# Altium schematic sheet ultrasound_wifi.SchDoc: Schematic
size D; Date: Not shown in title block; ApprovedBy: Not shown in title block; CheckedBy: Not shown in title block; Author: Not shown in title block; CompanyName: Not shown in title block; DrawnBy: Giovanni Campanella; Engineer: Giovanni Campanella; Organization: Not shown in title block; Address1: Not shown in title block; Address2: Not shown in title block; Address3: Not shown in title block; Address4: Not shown in title block; DocumentNumber: 1; Revision: Use project parameter SCH_Rev; SheetNumber: 2; SheetTotal: 3; PageSetup: Record=PageOptions|CenterHorizontal=True|CenterVertical=True|PrintScale=1.00|XCorrection=1.00|YCorrection=1.00|PrintKind=0|BorderSize=5000000|LeftOffset=0|BottomOffset=0|Orientation=2|PaperLength=1000|PaperWidth=1000|Scale=100|PaperSource=15|PrintQuality=600|MediaType=1|DitherType=10|PaperKind=Letter|PrintScaleMode=1; CurrentTime: Not shown in title block; CurrentDate: Not shown in title block; Time: Not shown in title block; DocumentFullPathAndName: Not shown in title block; DocumentName: Not shown in title block; ModifiedDate: Not shown in title block; ImagePath: Not shown in title block
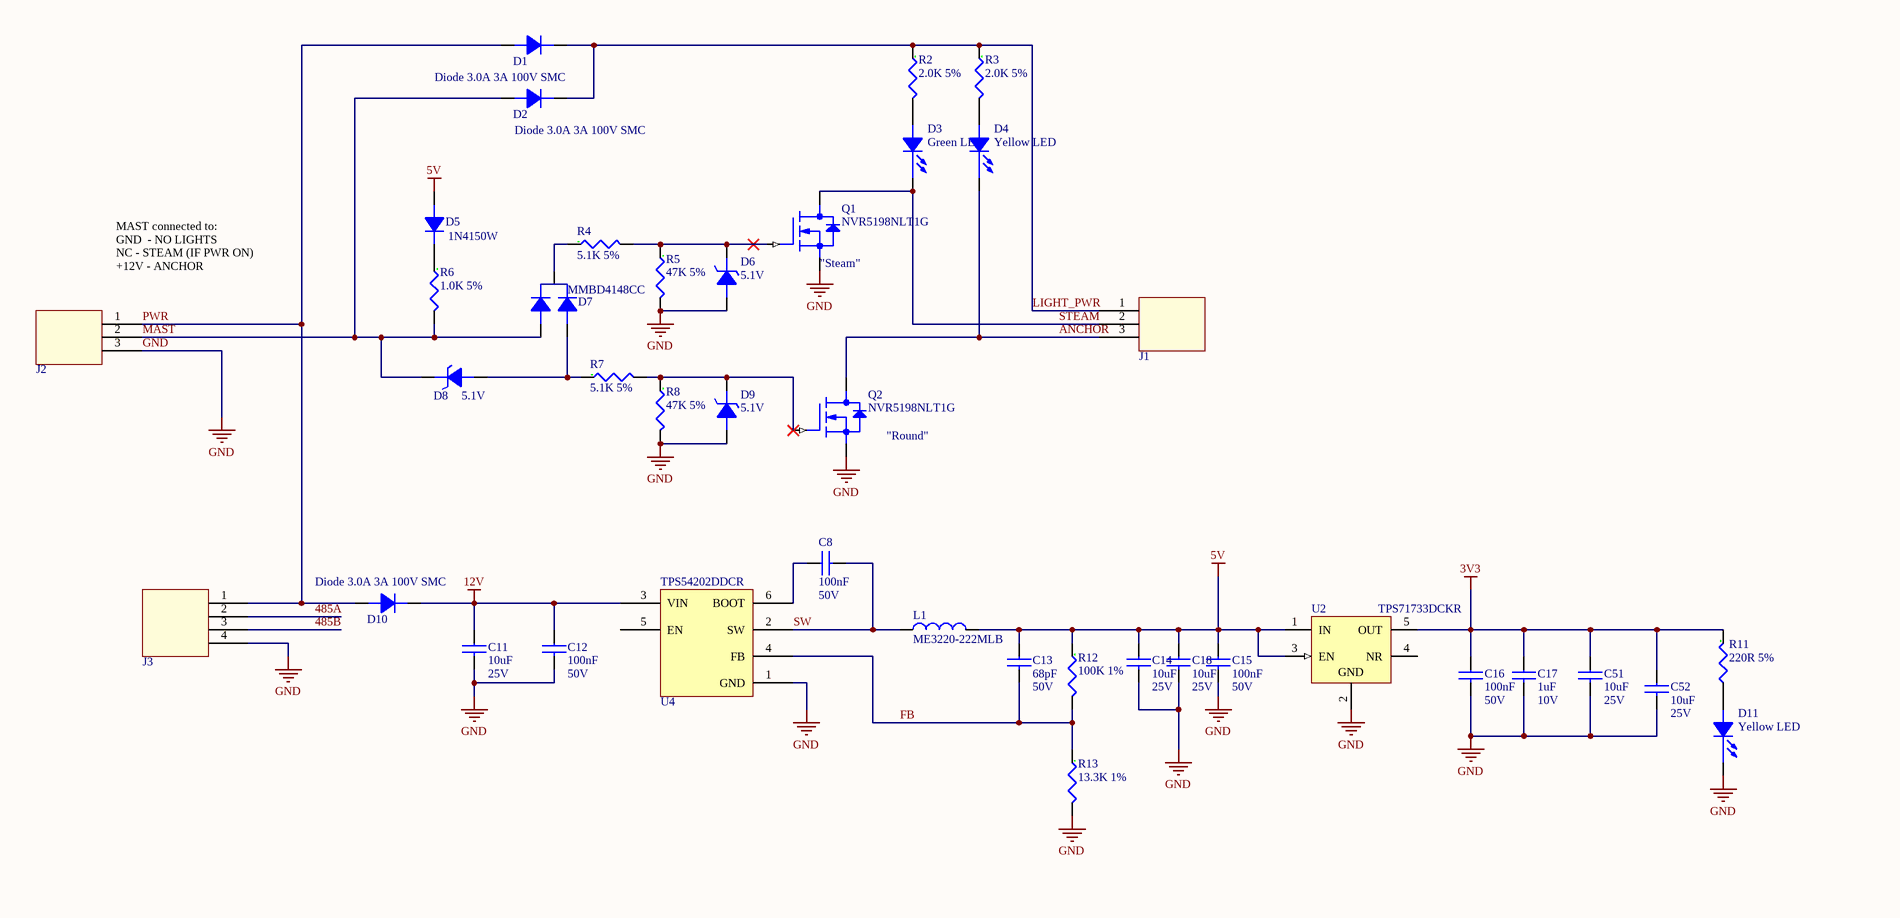
[diagram p0: ultrasound_wifi.SchDoc, top left]
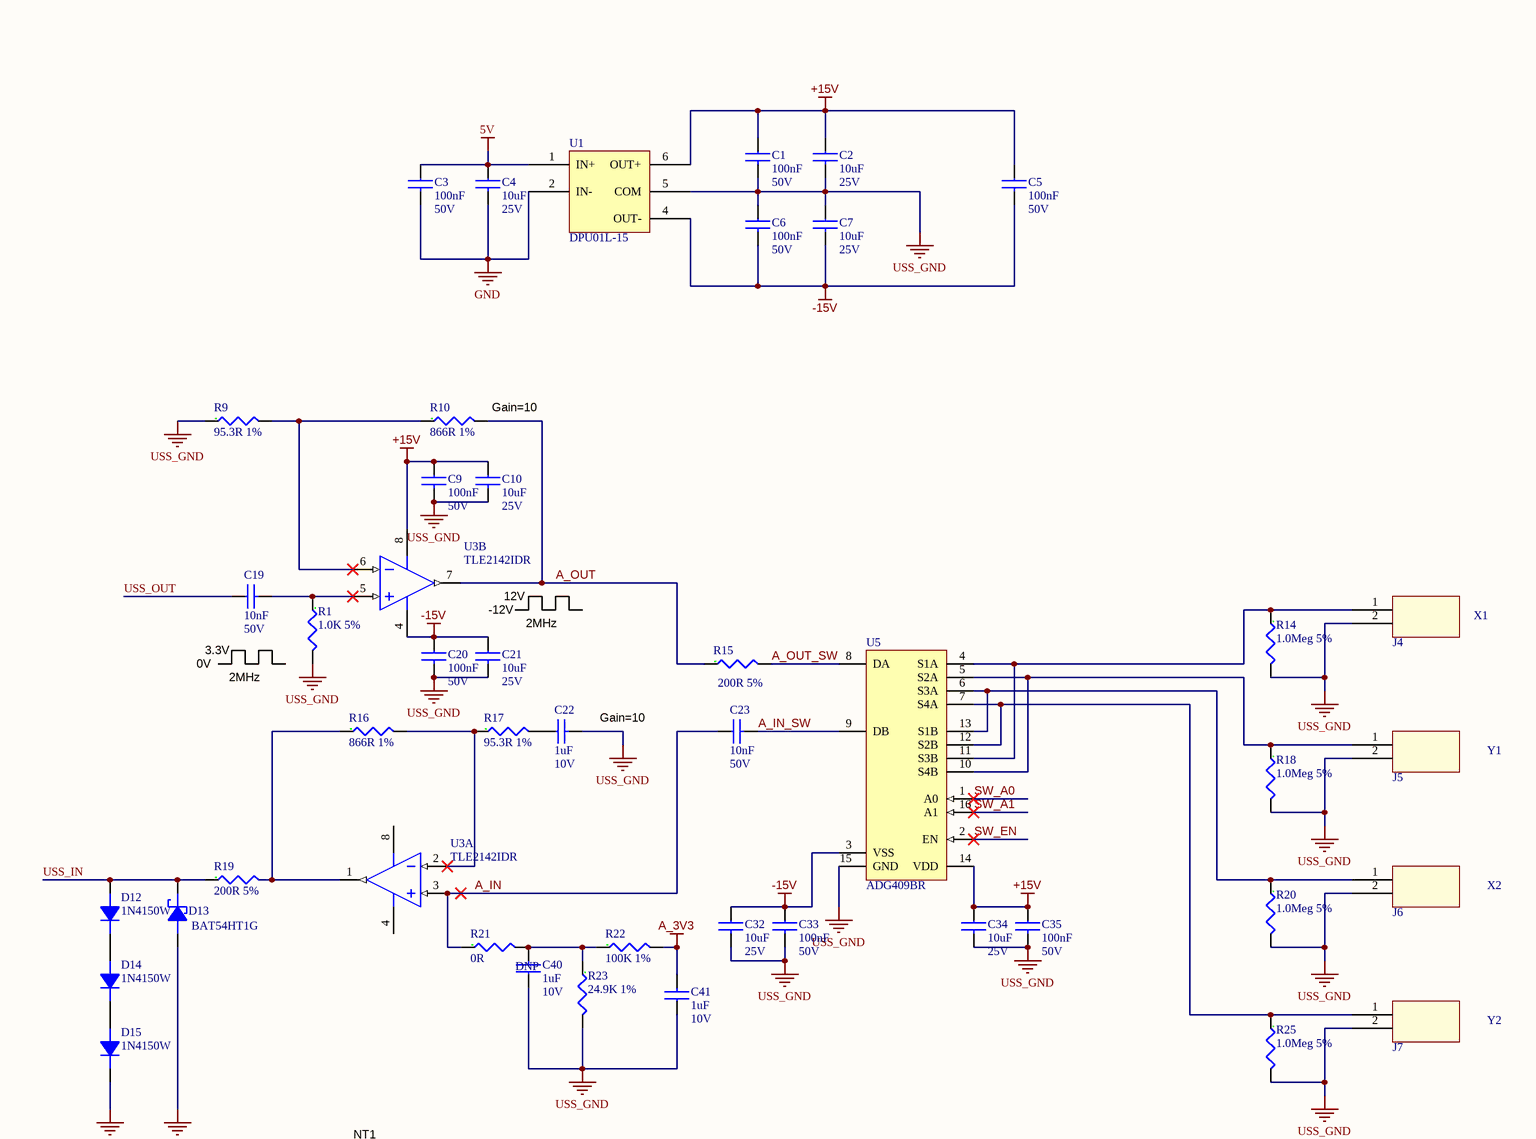
[diagram p1: ultrasound_wifi.SchDoc, top right]
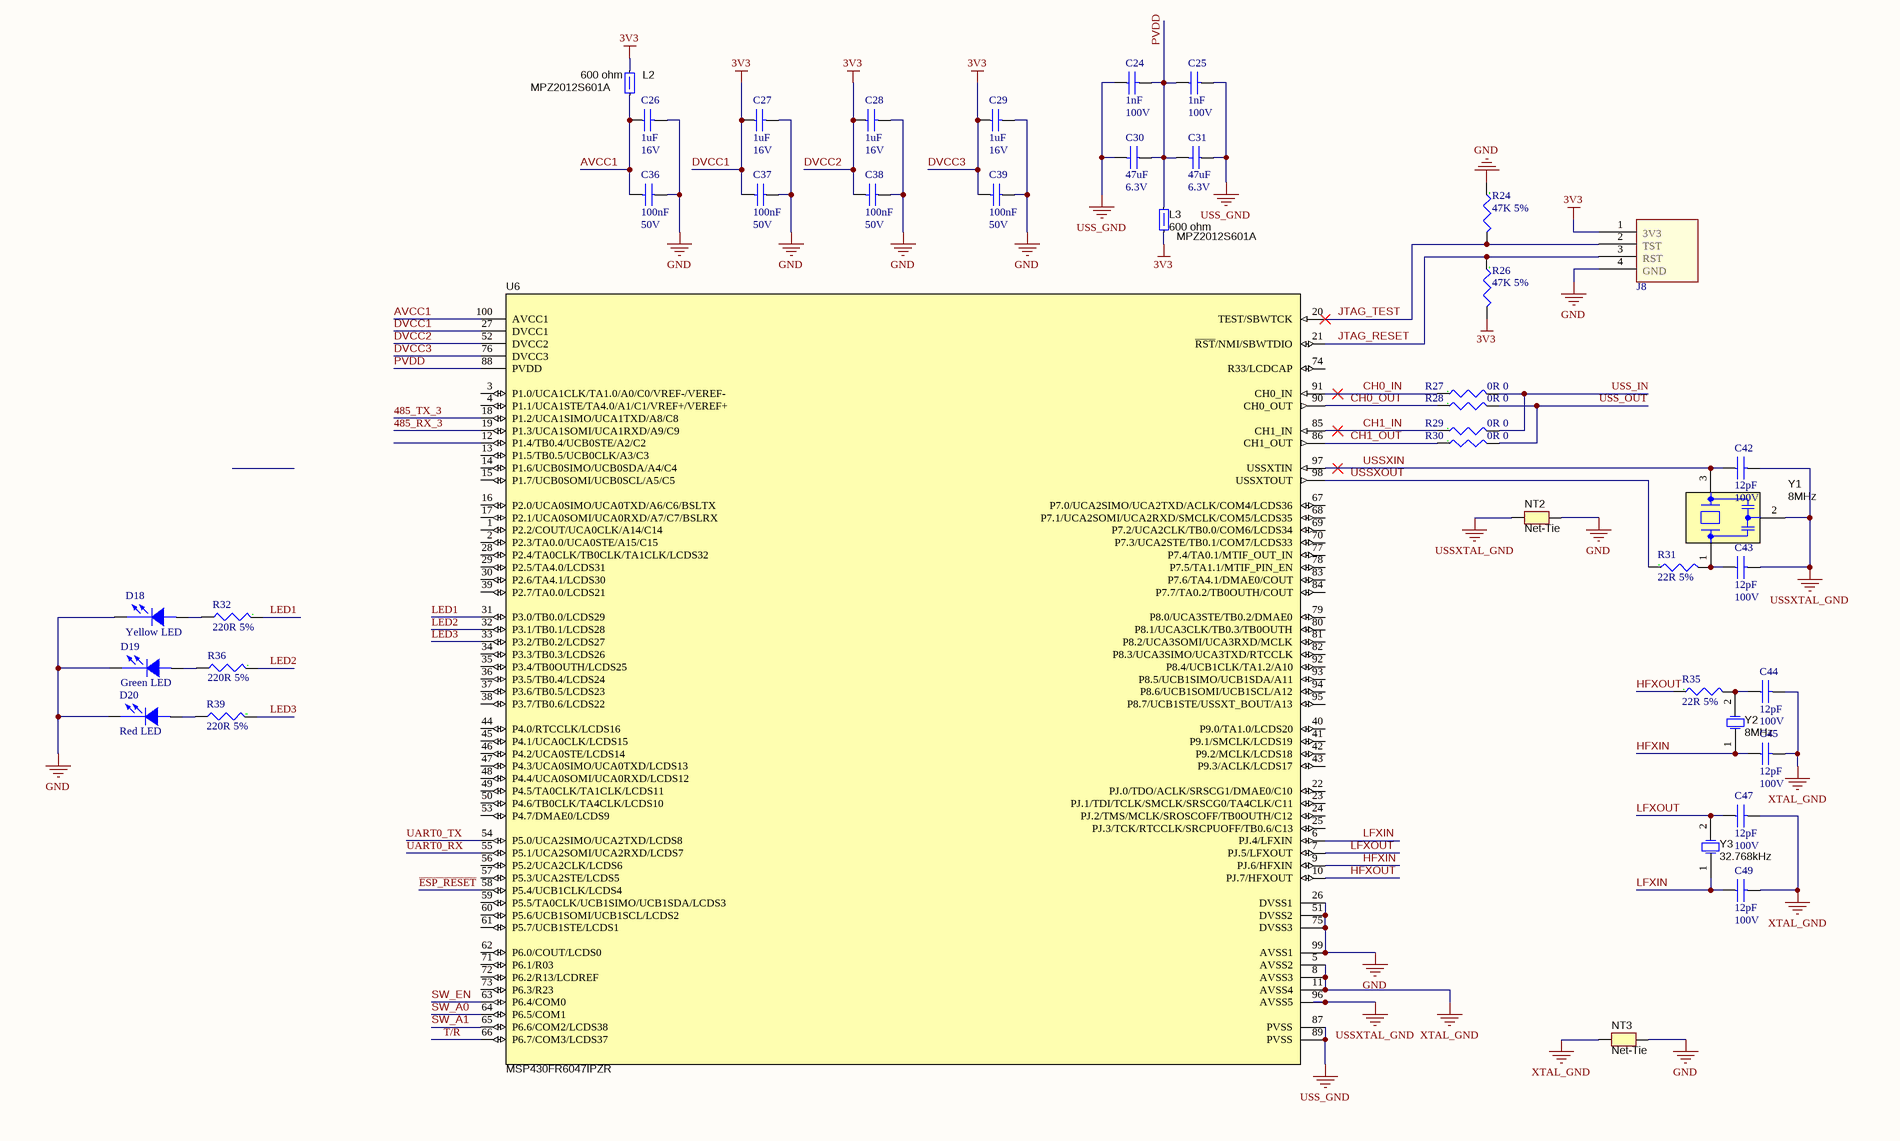
[diagram p2: ultrasound_wifi.SchDoc, bottom left]
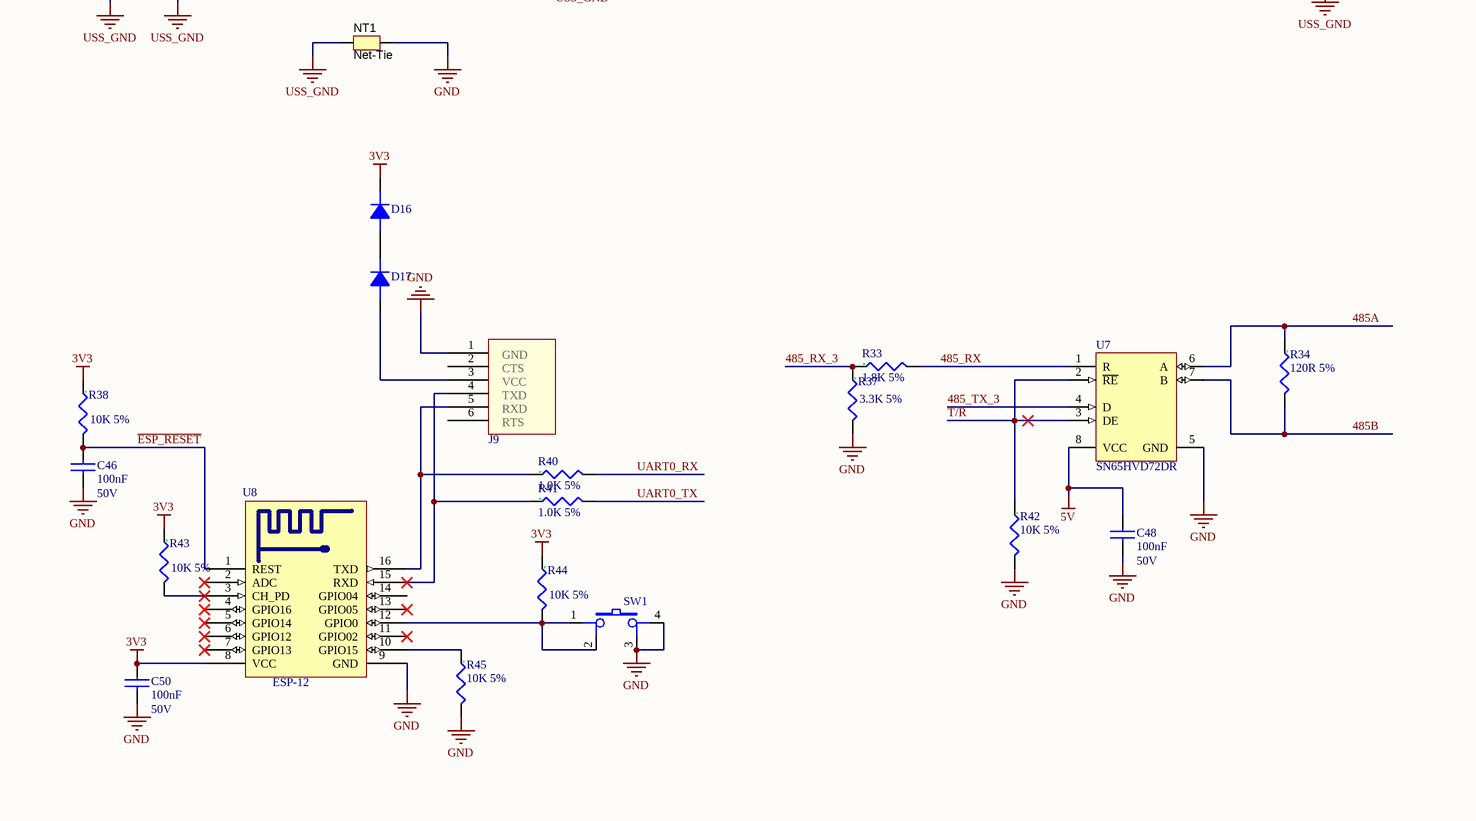
[diagram p3: ultrasound_wifi.SchDoc, bottom right]

## Parts
C1  value 100nF  Rated Voltage: 50V  [C_0603C]  (hidden comment: 100nF 50V)
C2  value 10uF  Rated Voltage: 25V  [C_0805C]  (hidden comment: 10uF 25V)
C3  value 100nF  Rated Voltage: 50V  [C_0603C]  (hidden comment: 100nF 50V)
C4  value 10uF  Rated Voltage: 25V  [C_0805C]  (hidden comment: 10uF 25V)
C5  value 100nF  Rated Voltage: 50V  [C_0603C]  (hidden comment: 100nF 50V)
C6  value 100nF  Rated Voltage: 50V  [C_0603C]  (hidden comment: 100nF 50V)
C7  value 10uF  Rated Voltage: 25V  [C_0805C]  (hidden comment: 10uF 25V)
C8  value 100nF  Rated Voltage: 50V  [C_0603C]  (hidden comment: 100nF 50V)
C9  value 100nF  Rated Voltage: 50V  [C_0603C]  (hidden comment: 100nF 50V)
C10  value 10uF  Rated Voltage: 25V  [C_0805C]  (hidden comment: 10uF 25V)
C11  value 10uF  Rated Voltage: 25V  [C_0805C]  (hidden comment: 10uF 25V)
C12  value 100nF  Rated Voltage: 50V  [C_0603C]  (hidden comment: 100nF 50V)
C13  value 68pF  Rated Voltage: 50V  [C_0603C]  (hidden comment: 68pF 50V)
C14  value 10uF  Rated Voltage: 25V  [C_0805C]  (hidden comment: 10uF 25V)
C15  value 100nF  Rated Voltage: 50V  [C_0603C]  (hidden comment: 100nF 50V)
C16  value 100nF  Rated Voltage: 50V  [C_0603C]  (hidden comment: 100nF 50V)
C17  value 1uF  Rated Voltage: 10V  [C_0603C]  (hidden comment: 1uF 10V)
C18  value 10uF  Rated Voltage: 25V  [C_0805C]  (hidden comment: 10uF 25V)
C19  value 10nF  Rated Voltage: 50V  [C_0603C]  (hidden comment: 10nF 50V)
C20  value 100nF  Rated Voltage: 50V  [C_0603C]  (hidden comment: 100nF 50V)
C21  value 10uF  Rated Voltage: 25V  [C_0805C]  (hidden comment: 10uF 25V)
C22  value 1uF  Rated Voltage: 10V  [C_0603C]  (hidden comment: 1uF 10V)
C23  value 10nF  Rated Voltage: 50V  [C_0603C]  (hidden comment: 10nF 50V)
C24  value 1nF  Rated Voltage: 100V  [C_0603C]  (hidden comment: 1nF 100V)
C25  value 1nF  Rated Voltage: 100V  [C_0603C]  (hidden comment: 1nF 100V)
C26  value 1uF  Rated Voltage: 16V  [C_0603C]  (hidden comment: 1uF 16V)
C27  value 1uF  Rated Voltage: 16V  [C_0603C]  (hidden comment: 1uF 16V)
C28  value 1uF  Rated Voltage: 16V  [C_0603C]  (hidden comment: 1uF 16V)
C29  value 1uF  Rated Voltage: 16V  [C_0603C]  (hidden comment: 1uF 16V)
C30  value 47uF  Rated Voltage: 6.3V  [C_0805C]  (hidden comment: 47uF 6.3V)
C31  value 47uF  Rated Voltage: 6.3V  [C_0805C]  (hidden comment: 47uF 6.3V)
C32  value 10uF  Rated Voltage: 25V  [C_0805C]  (hidden comment: 10uF 25V)
C33  value 100nF  Rated Voltage: 50V  [C_0603C]  (hidden comment: 100nF 50V)
C34  value 10uF  Rated Voltage: 25V  [C_0805C]  (hidden comment: 10uF 25V)
C35  value 100nF  Rated Voltage: 50V  [C_0603C]  (hidden comment: 100nF 50V)
C36  value 100nF  Rated Voltage: 50V  [C_0603C]  (hidden comment: 100nF 50V)
C37  value 100nF  Rated Voltage: 50V  [C_0603C]  (hidden comment: 100nF 50V)
C38  value 100nF  Rated Voltage: 50V  [C_0603C]  (hidden comment: 100nF 50V)
C39  value 100nF  Rated Voltage: 50V  [C_0603C]  (hidden comment: 100nF 50V)
C40  value 1uF  Rated Voltage: 10V  ASSY: DNP  [C_0603C]  (hidden comment: 1uF 10V)
C41  value 1uF  Rated Voltage: 10V  [C_0603C]  (hidden comment: 1uF 10V)
C42  value 12pF  Rated Voltage: 100V  [C_0603C]  (hidden comment: 12pF 100V)
C43  value 12pF  Rated Voltage: 100V  [C_0603C]  (hidden comment: 12pF 100V)
C44  value 12pF  Rated Voltage: 100V  [C_0603C]  (hidden comment: 12pF 100V)
C45  value 12pF  Rated Voltage: 100V  [C_0603C]  (hidden comment: 12pF 100V)
C46  value 100nF  Rated Voltage: 50V  [C_0603C]  (hidden comment: 100nF 50V)
C47  value 12pF  Rated Voltage: 100V  [C_0603C]  (hidden comment: 12pF 100V)
C48  value 100nF  Rated Voltage: 50V  [C_0603C]  (hidden comment: 100nF 50V)
C49  value 12pF  Rated Voltage: 100V  [C_0603C]  (hidden comment: 12pF 100V)
C50  value 100nF  Rated Voltage: 50V  [C_0603C]  (hidden comment: 100nF 50V)
C51  value 10uF  Rated Voltage: 25V  [C_0805C]  (hidden comment: 10uF 25V)
C52  value 10uF  Rated Voltage: 25V  [C_0805C]  (hidden comment: 10uF 25V)
D1  Diode 3.0A 3A 100V SMC  [DIODE-SMC]
D2  Diode 3.0A 3A 100V SMC  [DIODE-SMC]
D3  Green LED  [C_0603D]
D4  Yellow LED  [C_0603D]
D5  1N4150W  [SOD-123-12]
D6  5.1V  [SOD323-1]
D7  MMBD4148CC  [SOT23]
D8  5.1V  [SOD323-1]
D9  5.1V  [SOD323-1]
D10  Diode 3.0A 3A 100V SMC  [DIODE-SMC]
D11  Yellow LED  [C_0603D]
D12  1N4150W  [SOD-123-12]
D13  BAT54HT1G  [SOD323-1]
D14  1N4150W  [SOD-123-12]
D15  1N4150W  [SOD-123-12]
D16  1N4150W  [SOD-123-12]  (value not drawn)
D17  1N4150W  [SOD-123-12]  (value not drawn)
D18  Yellow LED  [C_0603D]
D19  Green LED  [C_0603D]
D20  Red LED  [C_0603D]
J1  MOLEX 26-60-4030  [MOLEX_26-60-4030]  (value not drawn)
J2  MOLEX 26-60-4030  [MOLEX_26-60-4030]  (value not drawn)
J3  MOLEX 22-23-2041  [MOLEX_22-23-2041]  (value not drawn)
J4  MOLEX 22-23-2021  [MOLEX_22-23-2021]  (value not drawn)
J5  MOLEX 22-23-2021  [MOLEX_22-23-2021]  (value not drawn)
J6  MOLEX 22-23-2021  [MOLEX_22-23-2021]  (value not drawn)
J7  MOLEX 22-23-2021  [MOLEX_22-23-2021]  (value not drawn)
J8  MSP340 PROG PADS  [MSP430PROG]  (value not drawn)
J9  MOLEX 22-23-2061  [MOLEX_22-23-2061]  (value not drawn)
L1  Manufacturer Part Number: ME3220-222MLB  [ME3220]  (hidden comment: ME3220 2.2uH)
L2  value 600 ohm  [0805L]  (hidden comment: MPZ2012S601A)
L3  value 600 ohm  [0805L]  (hidden comment: MPZ2012S601A)
NT1  Net-Tie  [Net-Tie_50milWide_30milLong]  (net tie, no BOM)
NT2  Net-Tie  [Net-Tie_50milWide_30milLong]  (net tie, no BOM)
NT3  Net-Tie  [Net-Tie_50milWide_30milLong]  (net tie, no BOM)
Q1  NVR5198NLT1G  [SOT23]
Q2  NVR5198NLT1G  [SOT23]
R1  1.0K 5%  [C_0603R]
R2  2.0K 5%  [C_0603R]
R3  2.0K 5%  [C_0603R]
R4  5.1K 5%  [C_0603R]
R5  47K 5%  [C_0603R]
R6  1.0K 5%  [C_0603R]
R7  5.1K 5%  [C_0603R]
R8  47K 5%  [C_0603R]
R9  95.3R 1%  [C_0603R]
R10  866R 1%  [C_0603R]
R11  220R 5%  [C_0603R]
R12  100K 1%  [C_0603R]
R13  13.3K 1%  [C_0603R]
R14  1.0Meg 5%  [C_0603R]
R15  200R 5%  [C_0603R]
R16  866R 1%  [C_0603R]
R17  95.3R 1%  [C_0603R]
R18  1.0Meg 5%  [C_0603R]
R19  200R 5%  [C_0603R]
R20  1.0Meg 5%  [C_0603R]
R21  0R  [C_0603R]
R22  100K 1%  [C_0603R]
R23  24.9K 1%  [C_0603R]
R24  47K 5%  [C_0603R]
R25  1.0Meg 5%  [C_0603R]
R26  47K 5%  [C_0603R]
R27  0R 0  [C_0603R]
R28  0R 0  [C_0603R]
R29  0R 0  [C_0603R]
R30  0R 0  [C_0603R]
R31  22R 5%  [C_0603R]
R32  220R 5%  [C_0603R]
R33  1.8K 5%  [C_0603R]
R34  120R 5%  [C_0603R]
R35  22R 5%  [C_0603R]
R36  220R 5%  [C_0603R]
R37  3.3K 5%  [C_0603R]
R38  10K 5%  [C_0603R]
R39  220R 5%  [C_0603R]
R40  1.0K 5%  [C_0603R]
R41  1.0K 5%  [C_0603R]
R42  10K 5%  [C_0603R]
R43  10K 5%  [C_0603R]
R44  10K 5%  [C_0603R]
R45  10K 5%  [C_0603R]
SW1  1571527  [ALCOSWICH_1571527]  (value not drawn)
U1  DPU01L-15  [DPU01]
U2  TPS71733DCKR  [SOT23-5]
U3  TLE2142IDR  [D0008A_N]  (parts A,B of 2)
U4  TPS54202DDCR  [SOT23-6_TPS54202]
U5  ADG409BR  [ADI-R-16_L]
U6  MSP430FR6047IPZR  [PZ0100A_N]
U7  SN65HVD72DR  [D0008A_M]
U8  ESP-12  [ESP_12]  (value not drawn)
Y1  Frequency: 8MHz  [Abracon_AWSCR-CV]  (hidden comment: AWSCR-8.00CV-T)
Y2  Frequency: 8MHz  [Abracon_ABM3]  (hidden comment: ABM3-8.000MHZ-D2Y-T)
Y3  Frequency: 32.768kHz  [XTAL_ABS07]  (hidden comment: ABS07-32.768KHZ-9-T)

## Nets
5V: C3.1 C4.1 C13.1 C14.1 C15.1 C18.1 C48.1 D5.1(A) L1.2 R12.1 U1.1(IN+) U2.1(IN) U2.3(EN) U7.8(VCC)
12V: C11.1 C12.1 D10.C(K) U4.3(VIN)
+15V: C1.1 C2.1 C5.1 C9.1 C10.1 C34.1 C35.1 U1.6(OUT+) U3.8(VCC+) U5.14(VDD)
-15V: C5.2 C6.2 C7.2 C20.1 C21.1 C32.1 C33.1 U1.4(OUT-) U3.4(VCC-) U5.3(VSS)
A_3V3: C41.2 R22.2
DVCC1: C16.1 C17.1 C27.1 C28.1 C29.1 C37.2 C38.2 C39.2 C50.1 C51.1 C52.1 D16.2(K) J8.1 L2.2 L3.2 R11.1 R26.2 R38.1 R43.1 R44.1 U2.5(OUT) U6.27(DVCC1) U6.52(DVCC2) U6.76(DVCC3) U8.8(VCC)  [also labelled 3V3, DVCC2, DVCC3]
GND: C3.2 C4.2 C11.2 C12.2 C14.2 C15.2 C16.2 C17.2 C18.2 C26.2 C27.2 C28.2 C29.2 C36.1 C37.1 C38.1 C39.1 C46.2 C48.2 C50.2 C51.2 C52.2 D6.A D9.A D11.2(C) D18.2(C) D19.2(C) D20.2(C) J2.3 J3.4 J8.4 J9.1 NT1.2 NT2.2 NT3.2 Q1.2(SOURCE) Q2.2(SOURCE) R5.2 R8.2 R13.2 R24.1 R37.2 R42.2 R45.2 SW1.3 SW1.4 U1.2(IN-) U2.2(GND) U4.1(GND) U6.26(DVSS1) U6.51(DVSS2) U6.75(DVSS3) U6.99(AVSS1) U7.5(GND) U8.9(GND)
USS_GND: C1.2 C2.2 C6.1 C7.1 C9.2 C10.2 C20.2 C21.2 C22.2 C24.1 C25.2 C30.2 C31.1 C32.2 C33.2 C34.2 C35.2 C40.1 C41.1 D13.A D15.2(K) J4.2 J5.2 J6.2 J7.2 NT1.1 R1.2 R9.1 R14.2 R18.2 R20.2 R23.2 R25.2 U1.5(COM) U5.15(GND) U6.87(PVSS) U6.89(PVSS)
USSXTAL_GND: C42.2 C43.2 NT2.1 U6.96(AVSS5) Y1.2(GND)
XTAL_GND: C44.2 C45.2 C47.2 C49.2 NT3.1 U6.5(AVSS2) U6.8(AVSS3) U6.11(AVSS4)
485_RX: R33.2 U7.1(R)
485_RX_3: R33.1 R37.1 U6.19(P1.3/UCA1SOMI/UCA1RXD/A9/C9)
485_TX_3: U6.18(P1.2/UCA1SIMO/UCA1TXD/A8/C8) U7.4(D)
485A: J3.2 R34.1 U7.6(A)
485B: J3.3 R34.2 U7.7(B)
A_IN: C23.1 R21.1 U3.3(IN1+)
A_IN_SW: C23.2 U5.9(DB)
A_OUT: R10.2 R15.1 U3.7(OUT2)
A_OUT_SW: R15.2 U5.8(DA)
ANCHOR: D4.2(C) J1.3 Q2.3(DRAIN)
AVCC1: C26.1 C36.2 L2.1 U6.100(AVCC1)
CH0_IN: R27.1 U6.91(CH0_IN)
CH0_OUT: R28.1 U6.90(CH0_OUT)
CH1_IN: R29.1 U6.85(CH1_IN)
CH1_OUT: R30.1 U6.86(CH1_OUT)
~{ESP_RESET}: C46.1 R38.2 U6.58(P5.4/UCB1CLK/LCDS4) U8.1(REST)
FB: C13.2 R12.2 R13.1 U4.4(FB)
HFXIN: C45.1 U6.9(PJ.6/HFXIN) Y2.1(OSC1)
HFXOUT: R35.1 U6.10(PJ.7/HFXOUT)
JTAG_RESET: J8.3 R26.1 U6.21(~{RST}/NMI/SBWTDIO)
JTAG_TEST: J8.2 R24.2 U6.20(TEST/SBWTCK)
LED1: R32.1 U6.31(P3.0/TB0.0/LCDS29)
LED2: R36.1 U6.32(P3.1/TB0.1/LCDS28)
LED3: R39.1 U6.33(P3.2/TB0.2/LCDS27)
LFXIN: C49.1 U6.6(PJ.4/LFXIN) Y3.1(OSC1)
LFXOUT: C47.1 U6.7(PJ.5/LFXOUT) Y3.2(OSC2)
LIGHT_PWR: D1.C(K) D2.C(K) J1.1 R2.1 R3.1
MAST: D2.A D7.1(A1) D8.C J2.2 R6.2
PVDD: C24.2 C25.1 C30.1 C31.2 L3.1 U6.88(PVDD)
PWR: D1.A D10.A J2.1 J3.1
STEAM: D3.2(C) J1.2 Q1.3(DRAIN)
SW: C8.2 L1.1 U4.2(SW)
SW_A0: U5.1(A0) U6.64(P6.5/COM1)
SW_A1: U5.16(A1) U6.65(P6.6/COM2/LCDS38)
SW_EN: U5.2(EN) U6.63(P6.4/COM0)
T/~{R}: R42.1 U6.66(P6.7/COM3/LCDS37) U7.2(~{RE}) U7.3(DE)
UART0_RX: R40.2 U6.55(P5.1/UCA2SOMI/UCA2RXD/LCDS7)
UART0_TX: R41.2 U6.54(P5.0/UCA2SIMO/UCA2TXD/LCDS8)
USS_IN: D12.1(A) D13.C R19.1 R27.2 R29.2
USS_OUT: C19.1 R28.2 R30.2
USSXIN: C42.1 U6.97(USSXTIN) Y1.3(Out)
USSXOUT: R31.1 U6.98(USSXTOUT)
NetC8_1: C8.1 U4.6(BOOT)
NetC19_2: C19.2 R1.1 U3.5(IN2+)
NetC22_1: C22.1 R17.2
NetC40_2: C40.2 R21.2 R22.1 R23.1
NetC43_1: C43.1 R31.2 Y1.1(In)
NetC44_1: C44.1 R35.2 Y2.2(OSC2)
NetD3_1: D3.1(A) R2.2
NetD4_1: D4.1(A) R3.2
NetD5_2: D5.2(K) R6.1
NetD6_C: D6.C Q1.1(GATE) R4.2 R5.1
NetD7_2: D7.2(A2) D8.A R7.1
NetD7_3: D7.3(K) R4.1
NetD9_C: D9.C Q2.1(GATE) R7.2 R8.1
NetD11_1: D11.1(A) R11.2
NetD12_2: D12.2(K) D14.1(A)
NetD14_2: D14.2(K) D15.1(A)
NetD16_1: D16.1(A) D17.2(K)
NetD17_1: D17.1(A) J9.3
NetD18_1: D18.1(A) R32.2
NetD19_1: D19.1(A) R36.2
NetD20_1: D20.1(A) R39.2
NetJ4_1: J4.1 R14.1 U5.4(S1A) U5.11(S3B)
NetJ5_1: J5.1 R18.1 U5.5(S2A) U5.10(S4B)
NetJ6_1: J6.1 R20.1 U5.6(S3A) U5.13(S1B)
NetJ7_1: J7.1 R25.1 U5.7(S4A) U5.12(S2B)
NetJ9_4: J9.4 R41.1 U8.15(RXD)
NetJ9_5: J9.5 R40.1 U8.16(TXD)
NetR9_2: R9.2 R10.1 U3.6(IN2-)
NetR16_1: R16.1 R19.2 U3.1(OUT1)
NetR16_2: R16.2 R17.1 U3.2(IN1-)
NetR43_2: R43.2 U8.3(CH_PD)
NetR44_2: R44.2 SW1.1 SW1.2 U8.12(GPIO0)
NetR45_1: R45.1 U8.10(GPIO15)

Not connected (* = marked no-connect by the designer): J9 2 6; U2 4(NR); U4 5(EN); U6 1(P2.2/COUT/UCA0CLK/A14/C14) 2(P2.3/TA0.0/UCA0STE/A15/C15) 3(P1.0/UCA1CLK/TA1.0/A0/C0/VREF-/VEREF-) 4(P1.1/UCA1STE/TA4.0/A1/C1/VREF+/VEREF+) 12(P1.4/TB0.4/UCB0STE/A2/C2) 13(P1.5/TB0.5/UCB0CLK/A3/C3) 14(P1.6/UCB0SIMO/UCB0SDA/A4/C4) 15(P1.7/UCB0SOMI/UCB0SCL/A5/C5) 16(P2.0/UCA0SIMO/UCA0TXD/A6/C6/BSLTX) 17(P2.1/UCA0SOMI/UCA0RXD/A7/C7/BSLRX) 22(PJ.0/TDO/ACLK/SRSCG1/DMAE0/C10) 23(PJ.1/TDI/TCLK/SMCLK/SRSCG0/TA4CLK/C11) 24(PJ.2/TMS/MCLK/SROSCOFF/TB0OUTH/C12) 25(PJ.3/TCK/RTCCLK/SRCPUOFF/TB0.6/C13) 28(P2.4/TA0CLK/TB0CLK/TA1CLK/LCDS32) 29(P2.5/TA4.0/LCDS31) 30(P2.6/TA4.1/LCDS30) 34(P3.3/TB0.3/LCDS26) 35(P3.4/TB0OUTH/LCDS25) 36(P3.5/TB0.4/LCDS24) 37(P3.6/TB0.5/LCDS23) 38(P3.7/TB0.6/LCDS22) 39(P2.7/TA0.0/LCDS21) 40(P9.0/TA1.0/LCDS20) 41(P9.1/SMCLK/LCDS19) 42(P9.2/MCLK/LCDS18) 43(P9.3/ACLK/LCDS17) 44(P4.0/RTCCLK/LCDS16) 45(P4.1/UCA0CLK/LCDS15) 46(P4.2/UCA0STE/LCDS14) 47(P4.3/UCA0SIMO/UCA0TXD/LCDS13) 48(P4.4/UCA0SOMI/UCA0RXD/LCDS12) 49(P4.5/TA0CLK/TA1CLK/LCDS11) 50(P4.6/TB0CLK/TA4CLK/LCDS10) 53(P4.7/DMAE0/LCDS9) 56(P5.2/UCA2CLK/LCDS6) 57(P5.3/UCA2STE/LCDS5) 59(P5.5/TA0CLK/UCB1SIMO/UCB1SDA/LCDS3) 60(P5.6/UCB1SOMI/UCB1SCL/LCDS2) 61(P5.7/UCB1STE/LCDS1) 62(P6.0/COUT/LCDS0) 67(P7.0/UCA2SIMO/UCA2TXD/ACLK/COM4/LCDS36) 68(P7.1/UCA2SOMI/UCA2RXD/SMCLK/COM5/LCDS35) 69(P7.2/UCA2CLK/TB0.0/COM6/LCDS34) 70(P7.3/UCA2STE/TB0.1/COM7/LCDS33) 71(P6.1/R03) 72(P6.2/R13/LCDREF) 73(P6.3/R23) 74(R33/LCDCAP) 77(P7.4/TA0.1/MTIF_OUT_IN) 78(P7.5/TA1.1/MTIF_PIN_EN) 79(P8.0/UCA3STE/TB0.2/DMAE0) 80(P8.1/UCA3CLK/TB0.3/TB0OUTH) 81(P8.2/UCA3SOMI/UCA3RXD/MCLK) 82(P8.3/UCA3SIMO/UCA3TXD/RTCCLK) 83(P7.6/TA4.1/DMAE0/COUT) 84(P7.7/TA0.2/TB0OUTH/COUT) 92(P8.4/UCB1CLK/TA1.2/A10) 93(P8.5/UCB1SIMO/UCB1SDA/A11) 94(P8.6/UCB1SOMI/UCB1SCL/A12) 95(P8.7/UCB1STE/USSXT_BOUT/A13); U8 2(ADC)* 4(GPIO16)* 5(GPIO14)* 6(GPIO12)* 7(GPIO13)* 11(GPIO02)* 13(GPIO05)* 14(GPIO04)

## Notes on the sheet
- MAST connected to:
  GND  - NO LIGHTS
  NC - STEAM (IF PWR ON)
  +12V - ANCHOR
- (near Q1) "Steam"
- (near Q2) "Round"
- (near R10) Gain=10
- (near C19) 3.3V
- (near C21) -12V
- 12V
- (near C21) 2MHz
- X1
- 0V
- 2MHz
- (near C22) Gain=10
- Y1
- X2
- Y2
- (near J8) 3V3
  TST
  RST
  GND
- (near J9) GND
  CTS
  VCC
  TXD
  RXD
  RTS
- (near U8) ESP-12
- Title
- Size:
- Date:
- File:
- D
- Number:
- Time:
- Revision:
- Sheet
- of

## Library data of the parts
C1 C3 C5 C6 C9 C12 C15 C16 C20 C33 C35-C39 C46 C48 C50 = CAP_CER_GP_100nF_20%_50V_X5R_0603: Capacitor ceramic multilayer SMD 100nF 20% X5R 50V 0603; Manufacturer: TDK; Manufacturer Part Number: C1608X5R1H104M080AA; PartCode: 1; Type: standard; Case-EIA: 0603; Case-Metric: 1608; Part Number: CAP_CER_GP_100nF_20%_50V_X5R_0603; Class: Capacitor Ceramic Multilayer; Class Code: CAP_CER; Tolerance: 20%; Temperature_code: X5R; ComponentLink1Description: Datasheet; ComponentLink1URL: http://www.mouser.com/ds/2/400/mlcc_commercial_general_en-266370.pdf; ComponentLink2Description: Data; ComponentLink2URL: https://product.tdk.com/en/search/capacitor/ceramic/mlcc/info?part_no=C1608X5R1H104M080AA; ComponentLink3Description: Mouser; ComponentLink3URL: http://www.mouser.com/search/ProductDetail.aspx?R=0virtualkey0virtualkeyC1608X5R1H104M080AA
C2 C4 C7 = CAP_CER_GP_10uF_20%_25V_JB_0805: Capacitor ceramic multilayer SMD 10uF 20% JB 25V 0805; Manufacturer: TDK; Manufacturer Part Number: C2012JB1E106M085AC; PartCode: 1; Type: standard; Case-EIA: 0805; Case-Metric: 2012; Part Number: CAP_CER_GP_10uF_20%_25V_JB_0805; Class: Capacitor Ceramic Multilayer; Class Code: CAP_CER; Tolerance: 20%; Temperature_code: JB; ComponentLink1Description: Datasheet; ComponentLink1URL: http://www.mouser.com/ds/2/400/mlcc_commercial_general_en-266370.pdf
C8 = CAP_CER_GP_100nF_10%_50V_X7R_0603: Capacitor ceramic multilayer SMD 100nF 10% X7R 50V 0603; Manufacturer: TDK; Manufacturer Part Number: C1608X7R1H104K080AA; PartCode: 1; Type: standard; Case-EIA: 0603; Case-Metric: 1608; GR: BUCK; Part Number: CAP_CER_GP_100nF_10%_50V_X7R_0603; Class: Capacitor Ceramic Multilayer; Class Code: CAP_CER; Tolerance: 10%; Temperature_code: X7R; ComponentLink1Description: Datasheet; ComponentLink1URL: http://www.mouser.com/ds/2/400/mlcc_commercial_general_en-266370.pdf; ComponentLink2Description: Data; ComponentLink2URL: https://product.tdk.com/en/search/capacitor/ceramic/mlcc/info?part_no=C1608X7R1H104K080AA; ComponentLink3Description: Mouser; ComponentLink3URL: http://www.mouser.com/search/ProductDetail.aspx?R=0virtualkey0virtualkeyC1608X7R1H104K080AA
C10 C11 C14 C18 C21 C32 C34 C51 C52 = CAP_CER_GP_10uF_20%_25V_X5R_0805: Capacitor ceramic multilayer SMD 10uF 20% X5R 25V 0805; Manufacturer: TDK; Manufacturer Part Number: C2012X5R1E106M085AC; PartCode: 1; Type: standard; Case-EIA: 0805; Case-Metric: 2012; Part Number: CAP_CER_GP_10uF_20%_25V_X5R_0805; Class: Capacitor Ceramic Multilayer; Class Code: CAP_CER; Tolerance: 20%; Temperature_code: X5R; ComponentLink1Description: Datasheet; ComponentLink1URL: http://www.mouser.com/ds/2/400/mlcc_commercial_general_en-266370.pdf
C13 = CAP_CER_GP_68pF_1%_50V_C0G_0603: Capacitor ceramic multilayer SMD 68pF 1% C0G 50V 0603; Manufacturer: TDK; Manufacturer Part Number: C1608C0G1H680F080AA; PartCode: 1; Type: standard; Case-EIA: 0603; Case-Metric: 1608; GR: BUCK; Part Number: CAP_CER_GP_68pF_1%_50V_C0G_0603; Class: Capacitor Ceramic Multilayer; Class Code: CAP_CER; Tolerance: 1%; Temperature_code: C0G; ComponentLink1Description: Datasheet; ComponentLink1URL: http://www.mouser.com/ds/2/400/mlcc_commercial_general_en-266370.pdf; ComponentLink2Description: Data; ComponentLink2URL: https://product.tdk.com/en/search/capacitor/ceramic/mlcc/info?part_no=C1608C0G1H680F080AA; ComponentLink3Description: Mouser; ComponentLink3URL: http://www.mouser.com/search/ProductDetail.aspx?R=0virtualkey0virtualkeyC1608C0G1H680F080AA
C17 C22 C40 C41 = CAP_CER_GP_1uF_20%_10V_X5R_0603: Capacitor ceramic multilayer SMD 1uF 20% X5R 10V 0603; Manufacturer: TDK; Manufacturer Part Number: C1608X5R1A105M080AC; PartCode: 1; Type: standard; Case-EIA: 0603; Case-Metric: 1608; Part Number: CAP_CER_GP_1uF_20%_10V_X5R_0603; Class: Capacitor Ceramic Multilayer; Class Code: CAP_CER; Tolerance: 20%; Temperature_code: X5R; ComponentLink1Description: Datasheet; ComponentLink1URL: http://www.mouser.com/ds/2/400/mlcc_commercial_general_en-266370.pdf
C19 C23 = CAP_CER_GP_10nF_20%_50V_X5R_0603: Capacitor ceramic multilayer SMD 10nF 20% X5R 50V 0603; Manufacturer: TDK; Manufacturer Part Number: C1608X5R1H103M080AA; PartCode: 1; Type: standard; Case-EIA: 0603; Case-Metric: 1608; Part Number: CAP_CER_GP_10nF_20%_50V_X5R_0603; Class: Capacitor Ceramic Multilayer; Class Code: CAP_CER; Tolerance: 20%; Temperature_code: X5R; ComponentLink1Description: Datasheet; ComponentLink1URL: http://www.mouser.com/ds/2/400/mlcc_commercial_general_en-266370.pdf
C24 C25 = CAP_CER_GP_1nF_20%_100V_X5R_0603: Capacitor ceramic multilayer SMD 1nF 20% X5R 100V 0603; Manufacturer: TDK; Manufacturer Part Number: C1608X5R2A102M080AA; PartCode: 1; Type: standard; Case-EIA: 0603; Case-Metric: 1608; Part Number: CAP_CER_GP_1nF_20%_100V_X5R_0603; Class: Capacitor Ceramic Multilayer; Class Code: CAP_CER; Tolerance: 20%; Temperature_code: X5R; ComponentLink1Description: Datasheet; ComponentLink1URL: http://www.mouser.com/ds/2/400/mlcc_commercial_midvoltage_en-469114.pdf
C26-C29 = CAP_CER_GP_1uF_20%_16V_X5R_0603: Capacitor ceramic multilayer SMD 1uF 20% X5R 16V 0603; Manufacturer: TDK; Manufacturer Part Number: C1608X5R1C105M080AA; PartCode: 1; Type: standard; Case-EIA: 0603; Case-Metric: 1608; Part Number: CAP_CER_GP_1uF_20%_16V_X5R_0603; Class: Capacitor Ceramic Multilayer; Class Code: CAP_CER; Tolerance: 20%; Temperature_code: X5R; ComponentLink1Description: Datasheet; ComponentLink1URL: http://www.mouser.com/ds/2/400/mlcc_commercial_general_en-266370.pdf
C30 C31 = CAP_CER_GP_47uF_20%_6.3V_JB_0805: Capacitor ceramic multilayer SMD 47uF 20% JB 6.3V 0805; Manufacturer: TDK; Manufacturer Part Number: C2012JB0J476M125AC; PartCode: 1; Type: standard; Case-EIA: 0805; Case-Metric: 2012; Part Number: CAP_CER_GP_47uF_20%_6.3V_JB_0805; Class: Capacitor Ceramic Multilayer; Class Code: CAP_CER; Tolerance: 20%; Temperature_code: JB; ComponentLink1Description: Datasheet; ComponentLink1URL: http://www.mouser.com/ds/2/400/mlcc_commercial_general_en-266370.pdf
C42-C45 C47 C49 = CAP_CER_GP_12pF_5%_100V_C0G_0603: Capacitor ceramic multilayer SMD 12pF 5% C0G 100V 0603; Manufacturer: TDK; Manufacturer Part Number: C1608C0G2A120J080AA; PartCode: 1; Type: standard; Case-EIA: 0603; Case-Metric: 1608; Part Number: CAP_CER_GP_12pF_5%_100V_C0G_0603; Class: Capacitor Ceramic Multilayer; Class Code: CAP_CER; Tolerance: 5%; Temperature_code: C0G; ComponentLink1Description: Datasheet; ComponentLink1URL: http://www.mouser.com/ds/2/400/mlcc_commercial_midvoltage_en-469114.pdf
D1 D2 D10 = S3B: Part Number: S3B; Manufacturer: Fairchild; PartCode: 3; Type: standard; Class: Si-Diode; STD Price: 0.114; Class Code: Diode; Case-EIA: SMC; Manufacturer Part Number: S3B
D3 D19 = LTST-C190GKT: LED ULTRA-BRIGHT GREEN SMT 0603; Manufacturer: Lite ON; PartCode: 1; Type: standard; Class: LED GRN; STD Price: 0.057; Case-EIA: 0603; Part Number: LTST-C190GKT; Class Code: LED; Manufacturer Part Number: LTST-C190GKT
D4 D11 = LTST-C190KSKT: LED ULTRA-BRIGHT YELLOW SMT 0603; Manufacturer: Lite ON; PartCode: 1; Type: standard; Class: LED YEL; STD Price: 0.057; Case-EIA: 0603; Part Number: LTST-C190KSKT; Class Code: LED; Manufacturer Part Number: LTST-C190KSKT
D5 D12 D14-D17 = 1N4150W: Si-Diode 1N4150W; Manufacturer: Vishay; PartCode: 1; Type: standard; STD Price: .045; Case-EIA: SOD-123; Part Number: 1N4150W; Class: Si-Diode; Class Code: DIODE; Manufacturer Part Number: 1N4150W
D6 D8 D9 = BZX384B5V1-E3-18: ZENNER 5.1V  5.1V SOD323; Manufacturer: Vishay; PartCode: 2; MFG2 Part Number: BZT52C5V1S-7-F; CLASS: Zenner diode; Type: standard; STD Price: 0.039; Part Number: BZX384B5V1-E3-18; Class Code: ZENNER; MFG2: Diodes Incorporated; Case-EIA: SOD323; Manufacturer Part Number: BZX384B5V1-E3-18
D7 = MMBD4148CC: Diode 200mA 200mA 100V SOT23; Manufacturer: Fairchild; PartCode: 3; Type: standard; Class: Si-Diode x2 KK; STD Price: 0.045; Part Number: MMBD4148CC; Class Code: Diode; Case-EIA: SOT23; Manufacturer Part Number: MMBD4148CC
D13 = BAT54HT1G: Schottky BAT54HT1G 200mA 30V SOD323; Manufacturer: ON Semiconductor; PartCode: 1; CLASS: Schottky Diode; Type: standard; STD Price: 0.059; Part Number: BAT54HT1G; Class Code: Schottky; Case-EIA: SOD323; Manufacturer Part Number: BAT54HT1G
D18 = LTST-C190KSKT: LED ULTRA-BRIGHT YELLOW SMT 0603; Manufacturer: Lite ON; PartCode: 1; Type: standard; Class: LED YEL; STD Price: 0.057; Case-EIA: 0603; GR: MCU; Manufacturer Part Number: LTST-C190KSKT; Class Code: LED
D20 = LTST-C190CKT: LED ULTRA-BRIGHT RED SMT 0603; Manufacturer: Lite ON; PartCode: 1; Type: standard; Class: LED RED; STD Price: 0.057; Case-EIA: 0603; Part Number: LTST-C190CKT; Class Code: LED; Manufacturer Part Number: LTST-C190CKT
J1 J2 = HEADER VERTICAL 0.156 SQ KEYED FRICT. LOCK 3P MOLEX 26-60-4030: PartCode: 2; ID: 30; Value: 1x3 0.156; Case-EIA: Header 0.156; Recommended: yes; STD Price: 0.13; Part Number: HEADER VERTICAL 0.156 SQ KEYED FRICT. LOCK 3P MOLEX 26-60-4030; Type: Standard; Class: HEADER VERTICAL; Class Code: HEADER VERTICAL; Connactor Type: 0.156 SQ KEYED FRICT. LOCK; Pin QTY: 3P; Manufacturer: MOLEX; Manufacturer Part Number: 26-60-4030; ComponentLink1Description: Datasheet; ComponentLink1URL: http://10.3.1.109/ftp/public/Electronics/Datasheet/026604060_sd.pdf; ComponentLink2Description: Catalog; ComponentLink2URL: http://10.3.1.109/ftp/public/Electronics/Datasheet/1688.pdf; DatasheetName: 026604060_sd.pdf
J3 = HEADER VERTICAL 0.100 SQ KEYED FRICT.LOCK 4P MOLEX 22-23-2041: PartCode: 2; ID: 17; Value: 1x4 0.100; Case-EIA: Header 0.100; Recommended: yes; STD Price: 0.117; Part Number: HEADER VERTICAL 0.100 SQ KEYED FRICT.LOCK 4P MOLEX 22-23-2041; Type: Standard; Class: HEADER VERTICAL; Class Code: HEADER VERTICAL; Connactor Type: 0.100 SQ KEYED FRICT.LOCK; Pin QTY: 4P; Manufacturer: MOLEX; Manufacturer Part Number: 22-23-2041; ComponentLink1Description: Datasheet; ComponentLink1URL: http://10.3.1.109/ftp/public/Electronics/Datasheet/022232031_sd.pdf; ComponentLink2Description: Catalog; ComponentLink2URL: http://10.3.1.109/ftp/public/Electronics/Datasheet/1686.pdf; DatasheetName: 022232031_sd.pdf
J4-J7 = HEADER VERTICAL 0.100 SQ KEYED FRICT.LOCK 2P MOLEX 22-23-2021: PartCode: 2; ID: 15; Value: 1x2 0.100; Case-EIA: Header 0.100; Recommended: yes; STD Price: 0.088; Part Number: HEADER VERTICAL 0.100 SQ KEYED FRICT.LOCK 2P MOLEX 22-23-2021; Type: Standard; Class: HEADER VERTICAL; Class Code: HEADER VERTICAL; Connactor Type: 0.100 SQ KEYED FRICT.LOCK; Pin QTY: 2P; Manufacturer: MOLEX; Manufacturer Part Number: 22-23-2021; ComponentLink1Description: Datasheet; ComponentLink1URL: http://10.3.1.109/ftp/public/Electronics/Datasheet/022232031_sd.pdf; ComponentLink2Description: Catalog; ComponentLink2URL: http://10.3.1.109/ftp/public/Electronics/Datasheet/1686.pdf; DatasheetName: 022232031_sd.pdf
J8 = MSP430PROG: ID: 99; Class: CON HEADER; Connactor Type: 100mls pads; Value: 1x4; Pin QTY: 4P; STD Price: 0; Part Number: MSP430PROG; Type: Standard (No BOM); Class Code: CON HEADER; Case-EIA: 100mls pads
J9 = HEADER VERTICAL 0.100 SQ KEYED FRICT.LOCK 6P MOLEX 22-23-2061: PartCode: 2; ID: 19; Value: 1x6 0.100; Case-EIA: Header 0.100; Recommended: yes; STD Price: 0.228; Part Number: HEADER VERTICAL 0.100 SQ KEYED FRICT.LOCK 6P MOLEX 22-23-2061; Type: Standard; Class: HEADER VERTICAL; Class Code: HEADER VERTICAL; Connactor Type: 0.100 SQ KEYED FRICT.LOCK; Pin QTY: 6P; Manufacturer: MOLEX; Manufacturer Part Number: 22-23-2061; ComponentLink1Description: Datasheet; ComponentLink1URL: http://10.3.1.109/ftp/public/Electronics/Datasheet/022232031_sd.pdf; ComponentLink2Description: Catalog; ComponentLink2URL: http://10.3.1.109/ftp/public/Electronics/Datasheet/1686.pdf; DatasheetName: 022232031_sd.pdf
L1 = ME3220-222MLB: Power Inductor ME3220-222MLB; Manufacturer: Coilcraft; PartCode: 2; ID: 11; Class Code: IND; Resistance: 104mOhm; Rated Current: 1.5; GR: BUCK; Part Number: ME3220-222MLB; Class: Power Inductor; Case-EIA: ME3220; ComponentLink1Description: Datasheet
L2 L3 = MPZ2012S601A: Ferrite Bead, 600 ohm @ 100 MHz, 2 A, 0805; Manufacturer: TDK; Alternate PartNumber: MPZ2012S601AT000; Imax_A: 2; DCR_ohm: 0.1; Value1: 0.1 ohm; Value2: 2A; ZTyp@100MHz_Ohm: 600; CompType: Ferrite Bead; SymbolVersion: 2009-06-02; PartNumber: MPZ2012S601A; MountType: SMT; PackageReference: 0805; Published: 2014-04-30; Publisher: Texas Instruments; LatestRevisionDate: 2016-04-05; ComponentLink1Description: Datasheet link; ComponentLink1URL: http://www.tdk.co.jp/tefe02/e9413_mpz.pdf; RoHS: Y; Supplier 1: Digi-Key; Supplier Part Number 1: 445-2206-1-ND; Supplier 2: Mouser; Supplier Part Number 2: 810-MPZ2012S601A; Supplier 3: Farnell; Supplier Part Number 3: 1669753
NT1-NT3 = Net-Tie: Single point connection between nets.; SymbolCreator: codlsc; SymbolVersion: 2009-07-01; MountType: SMT; PackageReference: N/A; Publisher: Texas Instruments; LatestRevisionDate: 2015-10-18; LatestRevisionNote: Added Alternate PartNumber and Alternate Manufacturer parameters to appropriate components.
Q1 Q2 = NVR5198NLT1G: MOSFET N-Chanel NVR5198NLT1G 60V 2200mA SOT-23; Manufacturer: On Semiconductor; PartCode: 2; ID: 6; Drain-Gate Voltage: 20V; Drain-Source Resistance: 155mOhm; Power: 400mW; Recommended: yes; STD price: 0.14; CLASS: MOSFET N-Chanel; Part Number: NVR5198NLT1G; Manufacturer Part Number: NVR5198NLT1G; Class Code: MOSFET; Class type: N-Chanel; Value: NVR5198NLT1G; Drain-Source Voltage: 60V; Max Current: 2200mA; Case-Metric: SOT-23; Case-EIA: SOT-23; ComponentLink1Description: Datasheet
R1 R6 R40 R41 = RES_1.0K_0603: Thick film Resistor 1.0K 5% 0603; Manufacturer: Panasonic; Manufacturer Part Number: ERJ-3GEYJ102V; PartCode: 1; Class Code: RES; Rated Voltage: 75V; Power: 0.1W; Case-Metric: 1608; Case-EIA: 0603; STD Price: 0.003; Part Number: RES_1.0K_0603; Type: Standard; Class: Thick film Resistor; ComponentLink1Description: Datasheet; ComponentLink1URL: http://10.3.1.109/ftp/public/Electronics/Datasheet/Panasonic%20ERJ%20Thick%20Film%20Chip%20Resistors.pdf
R2 R3 = RES_2.0K_0603: Thick film Resistor 2.0K 5% 0603; Manufacturer: Panasonic; Manufacturer Part Number: ERJ-3GEYJ202V; PartCode: 1; Class Code: RES; Rated Voltage: 75V; Power: 0.1W; Case-Metric: 1608; Case-EIA: 0603; STD Price: 0.003; Part Number: RES_2.0K_0603; Type: Standard; Class: Thick film Resistor; ComponentLink1Description: Datasheet; ComponentLink1URL: http://10.3.1.109/ftp/public/Electronics/Datasheet/Panasonic%20ERJ%20Thick%20Film%20Chip%20Resistors.pdf
R4 R7 = RES_5.1K_0603: Thick film Resistor 5.1K 5% 0603; Manufacturer: Panasonic; Manufacturer Part Number: ERJ-3GEYJ512V; PartCode: 1; Class Code: RES; Rated Voltage: 75V; Power: 0.1W; Case-Metric: 1608; Case-EIA: 0603; STD Price: 0.003; Part Number: RES_5.1K_0603; Type: Standard; Class: Thick film Resistor; ComponentLink1Description: Datasheet; ComponentLink1URL: http://10.3.1.109/ftp/public/Electronics/Datasheet/Panasonic%20ERJ%20Thick%20Film%20Chip%20Resistors.pdf
R5 R8 R24 R26 = RES_47K_0603: Thick film Resistor 47K 5% 0603; Manufacturer: Panasonic; Manufacturer Part Number: ERJ-3GEYJ473V; PartCode: 1; Class Code: RES; Rated Voltage: 75V; Power: 0.1W; Case-Metric: 1608; Case-EIA: 0603; STD Price: 0.003; Part Number: RES_47K_0603; Type: Standard; Class: Thick film Resistor; ComponentLink1Description: Datasheet; ComponentLink1URL: http://10.3.1.109/ftp/public/Electronics/Datasheet/Panasonic%20ERJ%20Thick%20Film%20Chip%20Resistors.pdf
R9 R17 = RES_95.3R_0603_1%: Thick film Resistor 95.3R 1% 0603; Manufacturer: Panasonic; Manufacturer Part Number: ERJ3EKF95R9V; PartCode: 1; Class Code: RES; Rated Voltage: 75V; Power: 0.1W; Case-Metric: 1608; Case-EIA: 0603; STD Price: 0.004; VALUE: 95.3R; Part Number: RES_95.3R_0603_1%; Type: Standard; Class: Thick film Resistor; Tolerance: 1%; ComponentLink1Description: Datasheet; ComponentLink1URL: http://10.3.1.109/ftp/public/Electronics/Datasheet/Panasonic%20Precision%20Thick%20Film%20Chip%20Resistors%20ERJ.pdf
R10 R16 = RES_866R_0603_1%: Thick film Resistor 866R 1% 0603; Manufacturer: Panasonic; Manufacturer Part Number: ERJ3EKF8660V; PartCode: 1; Class Code: RES; Rated Voltage: 75V; Power: 0.1W; Case-Metric: 1608; Case-EIA: 0603; STD Price: 0.004; VALUE: 866R; Part Number: RES_866R_0603_1%; Type: Standard; Class: Thick film Resistor; Tolerance: 1%; ComponentLink1Description: Datasheet; ComponentLink1URL: http://10.3.1.109/ftp/public/Electronics/Datasheet/Panasonic%20Precision%20Thick%20Film%20Chip%20Resistors%20ERJ.pdf
R11 R32 R36 R39 = RES_220R_0603: Thick film Resistor 220R 5% 0603; Manufacturer: Panasonic; Manufacturer Part Number: ERJ-3GEYJ221V; PartCode: 1; Class Code: RES; Rated Voltage: 75V; Power: 0.1W; Case-Metric: 1608; Case-EIA: 0603; STD Price: 0.003; Part Number: RES_220R_0603; Type: Standard; Class: Thick film Resistor; ComponentLink1Description: Datasheet; ComponentLink1URL: http://10.3.1.109/ftp/public/Electronics/Datasheet/Panasonic%20ERJ%20Thick%20Film%20Chip%20Resistors.pdf
R12 = RES_100K_0603_1%: Thick film Resistor 100K 1% 0603; Manufacturer: Panasonic; Manufacturer Part Number: ERJ3EKF1003V; PartCode: 1; Class Code: RES; Rated Voltage: 75V; Power: 0.1W; Case-Metric: 1608; Case-EIA: 0603; STD Price: 0.004; GR: BUCK; VALUE: 100K; Part Number: RES_100K_0603_1%; Type: Standard; Class: Thick film Resistor; Tolerance: 1%; ComponentLink1Description: Datasheet; ComponentLink1URL: http://10.3.1.109/ftp/public/Electronics/Datasheet/Panasonic%20Precision%20Thick%20Film%20Chip%20Resistors%20ERJ.pdf
R13 = RES_13.3K_0603_1%: Thick film Resistor 13.3K 1% 0603; Manufacturer: Panasonic; Manufacturer Part Number: ERJ3EKF1332V; PartCode: 1; Class Code: RES; Rated Voltage: 75V; Power: 0.1W; Case-Metric: 1608; Case-EIA: 0603; STD Price: 0.004; VALUE: 13.3K; Part Number: RES_13.3K_0603_1%; Type: Standard; Class: Thick film Resistor; Tolerance: 1%; ComponentLink1Description: Datasheet; ComponentLink1URL: http://10.3.1.109/ftp/public/Electronics/Datasheet/Panasonic%20Precision%20Thick%20Film%20Chip%20Resistors%20ERJ.pdf
R14 R18 R20 R25 = RES_1.0Meg_0603: Thick film Resistor 1.0Meg 5% 0603; Manufacturer: Panasonic; Manufacturer Part Number: ERJ-3GEYJ105V; PartCode: 1; Class Code: RES; Rated Voltage: 75V; Power: 0.1W; Case-Metric: 1608; Case-EIA: 0603; STD Price: 0.003; Part Number: RES_1.0Meg_0603; Type: Standard; Class: Thick film Resistor; ComponentLink1Description: Datasheet; ComponentLink1URL: http://10.3.1.109/ftp/public/Electronics/Datasheet/Panasonic%20ERJ%20Thick%20Film%20Chip%20Resistors.pdf
R15 R19 = RES_200R_0603: Thick film Resistor 200R 5% 0603; Manufacturer: Panasonic; Manufacturer Part Number: ERJ-3GEYJ201V; PartCode: 1; Class Code: RES; Rated Voltage: 75V; Power: 0.1W; Case-Metric: 1608; Case-EIA: 0603; STD Price: 0.003; Part Number: RES_200R_0603; Type: Standard; Class: Thick film Resistor; ComponentLink1Description: Datasheet; ComponentLink1URL: http://10.3.1.109/ftp/public/Electronics/Datasheet/Panasonic%20ERJ%20Thick%20Film%20Chip%20Resistors.pdf
R21 = RES_0R_0603: Thick film Resistor 0R  0603; Manufacturer: Panasonic; Manufacturer Part Number: ERJ-3GEY0R00V; PartCode: 1; Class Code: RES; Rated Voltage: 75V; Power: 0.1W; Case-Metric: 1608; Case-EIA: 0603; STD Price: 0.003; Part Number: RES_0R_0603; Type: Standard; Class: Thick film Resistor; ComponentLink1Description: Datasheet; ComponentLink1URL: http://10.3.1.109/ftp/public/Electronics/Datasheet/Panasonic%20ERJ%20Thick%20Film%20Chip%20Resistors.pdf
R22 = RES_100K_0603_1%: Thick film Resistor 100K 1% 0603; Manufacturer: Panasonic; Manufacturer Part Number: ERJ3EKF1003V; PartCode: 1; Class Code: RES; Rated Voltage: 75V; Power: 0.1W; Case-Metric: 1608; Case-EIA: 0603; STD Price: 0.004; VALUE: 100K; Part Number: RES_100K_0603_1%; Type: Standard; Class: Thick film Resistor; Tolerance: 1%; ComponentLink1Description: Datasheet; ComponentLink1URL: http://10.3.1.109/ftp/public/Electronics/Datasheet/Panasonic%20Precision%20Thick%20Film%20Chip%20Resistors%20ERJ.pdf
R23 = RES_24.9K_0603_1%: Thick film Resistor 24.9K 1% 0603; Manufacturer: Panasonic; Manufacturer Part Number: ERJ3EKF2492V; PartCode: 1; Class Code: RES; Rated Voltage: 75V; Power: 0.1W; Case-Metric: 1608; Case-EIA: 0603; STD Price: 0.004; VALUE: 24.9K; Part Number: RES_24.9K_0603_1%; Type: Standard; Class: Thick film Resistor; Tolerance: 1%; ComponentLink1Description: Datasheet; ComponentLink1URL: http://10.3.1.109/ftp/public/Electronics/Datasheet/Panasonic%20Precision%20Thick%20Film%20Chip%20Resistors%20ERJ.pdf
R27-R30 = RES_0R_0603_1%: Thick film Resistor 0R 0 0603; Manufacturer: Panasonic; Manufacturer Part Number: ERJ3EKF0000V; PartCode: 1; Class Code: RES; Tolerance: 0; Rated Voltage: 75V; Power: 0.1W; Case-Metric: 1608; Case-EIA: 0603; STD Price: 0.004; VALUE: 0R; Part Number: RES_0R_0603_1%; Type: Standard; Class: Thick film Resistor; ComponentLink1Description: Datasheet; ComponentLink1URL: http://10.3.1.109/ftp/public/Electronics/Datasheet/Panasonic%20Precision%20Thick%20Film%20Chip%20Resistors%20ERJ.pdf
R31 R35 = RES_22R_0603: Thick film Resistor 22R 5% 0603; Manufacturer: Panasonic; Manufacturer Part Number: ERJ-3GEYJ220V; PartCode: 1; Class Code: RES; Rated Voltage: 75V; Power: 0.1W; Case-Metric: 1608; Case-EIA: 0603; STD Price: 0.003; Part Number: RES_22R_0603; Type: Standard; Class: Thick film Resistor; ComponentLink1Description: Datasheet; ComponentLink1URL: http://10.3.1.109/ftp/public/Electronics/Datasheet/Panasonic%20ERJ%20Thick%20Film%20Chip%20Resistors.pdf
R33 = RES_1.8K_0603: Thick film Resistor 1.8K 5% 0603; Manufacturer: Panasonic; Manufacturer Part Number: ERJ-3GEYJ182V; PartCode: 1; Class Code: RES; Rated Voltage: 75V; Power: 0.1W; Case-Metric: 1608; Case-EIA: 0603; STD Price: 0.003; Part Number: RES_1.8K_0603; Type: Standard; Class: Thick film Resistor; ComponentLink1Description: Datasheet; ComponentLink1URL: http://10.3.1.109/ftp/public/Electronics/Datasheet/Panasonic%20ERJ%20Thick%20Film%20Chip%20Resistors.pdf
R34 = RES_120R_0603: Thick film Resistor 120R 5% 0603; Manufacturer: Panasonic; Manufacturer Part Number: ERJ-3GEYJ121V; PartCode: 1; Class Code: RES; Rated Voltage: 75V; Power: 0.1W; Case-Metric: 1608; Case-EIA: 0603; STD Price: 0.003; Part Number: RES_120R_0603; Type: Standard; Class: Thick film Resistor; ComponentLink1Description: Datasheet; ComponentLink1URL: http://10.3.1.109/ftp/public/Electronics/Datasheet/Panasonic%20ERJ%20Thick%20Film%20Chip%20Resistors.pdf
R37 = RES_3.3K_0603: Thick film Resistor 3.3K 5% 0603; Manufacturer: Panasonic; Manufacturer Part Number: ERJ-3GEYJ332V; PartCode: 1; Class Code: RES; Rated Voltage: 75V; Power: 0.1W; Case-Metric: 1608; Case-EIA: 0603; STD Price: 0.003; Part Number: RES_3.3K_0603; Type: Standard; Class: Thick film Resistor; ComponentLink1Description: Datasheet; ComponentLink1URL: http://10.3.1.109/ftp/public/Electronics/Datasheet/Panasonic%20ERJ%20Thick%20Film%20Chip%20Resistors.pdf
R38 R42-R45 = RES_10K_0603: Thick film Resistor 10K 5% 0603; Manufacturer: Panasonic; Manufacturer Part Number: ERJ-3GEYJ103V; PartCode: 1; Class Code: RES; Rated Voltage: 75V; Power: 0.1W; Case-Metric: 1608; Case-EIA: 0603; STD Price: 0.003; Part Number: RES_10K_0603; Type: Standard; Class: Thick film Resistor; ComponentLink1Description: Datasheet; ComponentLink1URL: http://10.3.1.109/ftp/public/Electronics/Datasheet/Panasonic%20ERJ%20Thick%20Film%20Chip%20Resistors.pdf
SW1 = SWKEY 6x6mm 1571527: SWITCH, KEY, SMD,6x6mm; Manufacturer: TE Connectivity; PartCode: 2; CLASS: Switch Tact key; ID: 3; Class Code: SWKEY; Recommended: yes; STD Price: 0.15; Part Number: SWKEY 6x6mm 1571527; Type: Standard; Value: 1571527; Manufacturer Part Number: 1571527; MFG2: Alcoswitch; MFG2 Part Number: 1571527; ComponentLink1Description: Datasheet; ComponentLink1URL: http://10.3.1.109/ftp/public/Electronics/Datasheet/NG_CD_2-1437565-7_U1-199271.pdf; DatasheetName: NG_CD_2-1437565-7_U1-199271.pdf
U2 = TPS71733DCKR: Single Output High PSRR LDO, 150 mA, Fixed 3.3 V Output, 2.5 to 6.5 V Input, with Low IQ, 5-pin SC70 (DCK), -40 to 85 degC, Green (RoHS & no Sb/Br); Manufacturer: Texas Instruments; Accuracy(%): 3; Fixed Output Options(V): 3.3; Iout(Max)(A): 0.15; Iq(Typ)(mA): 0.05; SubFamily: Single Channel LDO; Vdo(Typ)(mV): 170; Vin(Max)(V): 6.5; Vin(Min)(V): 2.5; Case-EIA: MO-203; DatasheetVersion: SBVS068G; PackageVersion: 4093553-3/G; PackageReference: DCK5; PackageDescription: 5-Pin Plastic Small-Outline, Body 2 x 1.25 mm, Pitch 0.65 mm; Supplier 1: Digi-Key; Supplier Part Number 1: 296-19675-2-ND; Supplier 2: Digi-Key; Supplier Part Number 2: 296-19675-1-ND; Supplier 3: Digi-Key; Supplier Part Number 3: 296-19675-6-ND; Supplier 4: Farnell; Supplier Part Number 4: 2120472; Supplier 5: Newark; Supplier Part Number 5: 94T5104; Supplier 6: Newark; Supplier Part Number 6: 85K1732; Supplier 7: Mouser; Supplier Part Number 7: 595-TPS71733DCKR; Eco-Plan: Green (RoHS & no Sb/Br); Vout Adj(Max)(V): 3.3; Vout Adj(Min)(V): 3.3; Mounting Technology: Surface Mount; Code_JEDEC: MO-203; PartNumber: TPS71733DCKR; ComponentLink1Description: Manufacturer URL; ComponentLink1URL: http://www.ti.com/; ComponentLink2Description: Datasheet; ComponentLink2URL: http://www.ti.com/general/docs/lit/getliterature.tsp?genericPartNumber=TPS71733&fileType=pdf; ComponentLink3Description: Package Specification; ComponentLink3URL: http://www.ti.com/litv/pdf/mpds025f; Manufacturer Part Number: TPS71733DCKR
U3 = CMP-0272-02110-3: Dual Low-Noise High-Speed Precision Operational Amplifier, 4 to 44 V, -40 to 105 degC, 8-pin SOIC (D8), Green (RoHS & no Sb/Br); Manufacturer: Texas Instruments; Packing: LARGE T&R; Iq per channel(Max)(mA): 4.4; Number of Channels: 2; Vio (25C)(Max)(mV): 1.9; IIB(Max)(pA): 2000000; Total Supply Voltage(Min)(+5V is 5, +/-5V is 10): 4; Rating: Catalog; Slew Rate(Typ)(V/us): 45; Offset Drift(Typ)(uV/C): 1.7; Sub Family: High Output Current Amplifier (>=50mA), High Supply Voltage Amplifier (>=30V), Precision Amplifier; GBW(Typ)(MHz): 5.8; Total Supply Voltage(Max)(+5V is 5, +/-5V is 10): 44; CMRR(Min)(dB): 85; ComponentLink1URL: http://www.ti.com/; PackageReference: D0008A; ComponentLink3URL: http://www.ti.com/litv/pdf/msoi002j; PackageDescription: 8-Pin Plastic Small Outline, Body 4.9 x 3.9 mm, Pitch 1.27 mm; ComponentLink2Description: Datasheet; PackageVersion: 4040047-3/M, 06/2011; Eco-Plan: Green (RoHS & no Sb/Br); PartNumber: TLE2142IDR; Code_JEDEC: MS-012; DatasheetVersion: SLOS183D; ComponentLink2URL: http://www.ti.com/lit/ds/symlink/tle2142.pdf; ComponentLink1Description: Manufacturer URL; Mounting Technology: Surface Mount; ComponentLink3Description: Package Specification
U4 = TPS54202DDCR: IC OTHER TPS54202DDCR; Manufacturer: Texas Instruments; PartCode: 1; Case-EIA: SOT23; GR: BUCK; Manufacturer Part Number: TPS54202DDCR; Type: standard; Class: IC OTHER; Class Code: IC; ClassName: POWERIC
U5 = CMP-0793-00074-1: LC2MOS 4-Channel High Performance Analog Multiplexer, 40 Ohm / 90 Ohm Ron, 16-pin SOIC (R-16), Tube; Manufacturer: Analog Devices; Max Analog Signal Range: Vss to Vdd; Ron (ohms): 40; t transition (s): 120n; PackageDescription: 16-Pin Standard Small Outline Package, Body 9.9 x 3.9 mm, Pitch 1.27 mm; PackageReference: R-16; ComponentLink3URL: http://www.analog.com/static/imported-files/packages/PKG_PDF/SOIC_Narrow%20(R)/R_16.pdf; ComponentLink1URL: http://www.analog.com/en/index.html; Mounting Technology: Surface Mount; Packing: Tube; PartNumber: ADG409BR; ComponentLink3Description: Package Specification; ComponentLink1Description: Manufacturer URL; PackageVersion: 060606-A, 06/2006; ComponentLink2URL: http://www.analog.com/static/imported-files/data_sheets/ADG408_409.pdf; ComponentLink2Description: Datasheet; Code_JEDEC: MS-012-AC; DatasheetVersion: Rev. C
U6 = MSP430FR6047IPZR: Mixed-Signal Microcontroller, PZ0100A (LQFP-100); Manufacturer: Texas Instruments; SymbolCreator: Altium; SizeArea_mm2: 256; SizeAreaWB_mm2: 324; SizeX_mm: 16; SizeZ_mm: 1.6; CompType: IC; U/M: EA; SymbolVersion: 2016-11-29; PartNumber: MSP430FR6047IPZR; Alternate PartNumber: MSP430FR6047IPZ; PackageReference: PZ0100A; PackageDescription: LQFP-100; MountType: SMT; SizeY_mm: 16; ComponentLink1Description: Datasheet Link; ComponentLink1URL: https://sps06.itg.ti.com/sites/KMS/crossdivteams/altium/docs/ComponentDatasheets/SLASEB7_MSP430FR6047_Int.pdf; Publisher: Texas Instruments; LatestRevisionDate: 2016-11-30; Alternate Manufacturer: Texas Instruments
U7 = CMP-0694-00004-2: 3.3 V Supply RS-485 with IEC ESD Protection, 0.25 Mbps, -40 to 125 degC, 8-Pin SOIC, RoHS, Tape and Reel; Manufacturer: Texas Instruments; Manufacturer Part Number: ST485CDR; Manufacturer: STMicroelectronics; VI: -7 to 12 V; No. of RX: 1; ICC (Max) (mA): 0.95; ESD: 15 kV; VCC: 3 to 3.6 V; Signaling Rate (Max) (Mbps): 0.25; Packing: Tape and Reel; PackageReference: D0008A; ComponentLink3URL: http://www.ti.com/lit/ds/sllse11c/sllse11c.pdf; RoHS: TRUE; Operating Temperature Range: -40 to 125 degC; ComponentLink1Description: Manufacturer URL; Mounting Technology: Surface Mount; ComponentLink1URL: http://www.ti.com/; ComponentLink3Description: Package Specification; No. of TX: 1; PackageDescription: 8-Pin Plastic Small Outline, Body 4.9 x 3.9 mm, Pitch 1.27 mm; ComponentLink2Description: Datasheet; DatasheetVersion: SLLSE11C; ComponentLink2URL: http://www.ti.com/lit/ds/sllse11c/sllse11c.pdf; PackageVersion: 4040047-3/M; PartNumber: SN65HVD72DR
Y1 = AWSCR-8.00CV-T: Ceramic Resonator, 8MHz, 22pF, SMD; Manufacturer: Abracon Corporation; SymbolCreator: a0799721; SizeAreaWB_mm2: 19.27; SizeArea_mm2: 11.47; SizeX_mm: 3.7; SizeY_mm: 3.1; SizeZ_mm: 1.2; U/M: EA; TaMin_C: -25; TaMax_C: 85; SymbolVersion: 2016-2-15; PartNumber: AWSCR-8.00CV-T; CompType: Resonator; PackageReference: 3.7x3.1mm; MountType: SMT; RoHS: Y; ComponentLink1Description: Datasheet Link; ComponentLink1URL: http://www.abracon.com/Resonators/AWSCR_CV.pdf; Publisher: Texas Instruments; LatestRevisionDate: 2017-02-02; Supplier 1: Digi-Key; Supplier Part Number 1: 535-10004-1-ND; Supplier 2: Mouser; Supplier Part Number 2: 815-AWSCR-8.00CV-T
Y2 = ABM3-8.000MHZ-D2Y-T: Crystal, 8MHz, SMD; Manufacturer: Abracon Corporation; SymbolCreator: a0412235; U/M: EA; TaMin_C: -40; TaMax_C: 85; Frequency Stability: ±30ppm; SymbolVersion: 2008-07-09; PartNumber: ABM3-8.000MHZ-D2Y-T; CompType: Crystal; PackageReference: SMD, 2-Leads, Body 3.2x1.3x5 mm; MountType: SMT; RoHS: E; ComponentLink1Description: Datasheet Link; ComponentLink1URL: http://www.abracon.com/Resonators/abm3.pdf; Publisher: Texas Instruments; LatestRevisionDate: 2017-02-02; Supplier 1: Digi-Key; Supplier Part Number 1: 535-10630-1-ND; Supplier 2: Mouser; Supplier Part Number 2: 815-ABM3-8-D2Y-T; Supplier 3: Farnell; Supplier Part Number 3: 2101329
Y3 = ABS07-32.768KHZ-9-T: CRYSTAL, 32.768KHZ, 9PF, SMD; Manufacturer: Abracon Corporation; SymbolCreator: a0412235; U/M: EA; TaMin_C: -40; TaMax_C: 85; Frequency Stability: ±20ppm; SymbolVersion: 2008-07-09; PartNumber: ABS07-32.768KHZ-9-T; CompType: Crystal; PackageReference: 3.2x0.9x1.5mm; MountType: SMT; RoHS: Y; ComponentLink1Description: Datasheet Link; ComponentLink1URL: http://www.abracon.com/Resonators/ABS07.pdf; Publisher: Texas Instruments; LatestRevisionDate: 2016-11-29; Supplier 1: Digi-Key; Supplier Part Number 1: 535-9544-1-ND; Supplier 2: Mouser; Supplier Part Number 2: 815-ABS07-32.768K9T; Supplier 3: Farnell; Supplier Part Number 3: 2101346
U1 = DPU01L-15: PartNumber: DPU01L-15